# EAGLE design scema (EAGLE 6.5.0)
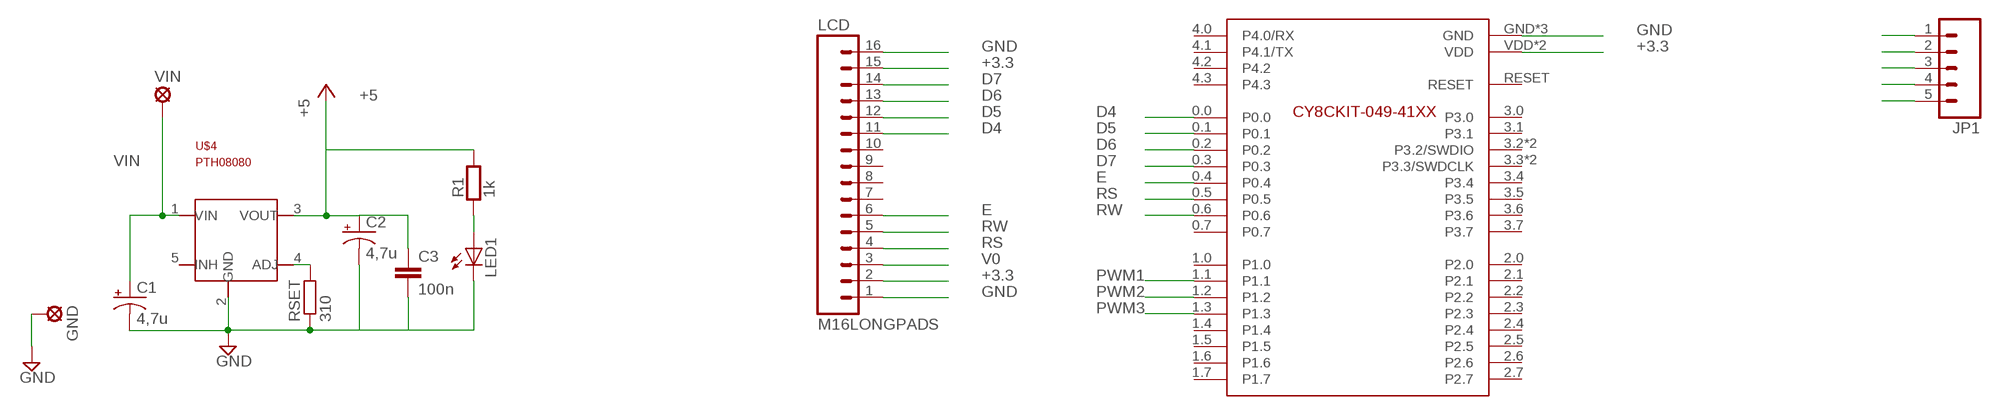
[diagram p0: schematic, sheet 1]

## Parts
C1  4,7u  CAP_POLPTH2  [CPOL-RADIAL-10UF-25V]
C2  4,7u  CAP_POLPTH2  [CPOL-RADIAL-10UF-25V]
C3  100n  CAPPTH2  [CAP-PTH-SMALL2]
GND  SE14  [SE14]
JP1  M05PTH_LONGPADS  [1X05_LONGPADS]
LCD  M16LONGPADS  [1X16_LONGPADS]
LED1  LEDSML0805  [SML0805]
R1  1k  R0805  [0805]
RSET  310  R-EU_R0805  [R0805]
U$1  PSOC4DEV  [CY8CKIT-049-41XX]
U$4  PTH08080  [PTH08080EUF]
VIN  SE14  [SE14]

## Nets
+3.3: JP1.1 LCD.2 LCD.15 U$1.VDD U$1.VDD2(VDD)
+5: C2.1(+) C3.1 R1.2 U$4.3(VOUT)
D4: LCD.11 U$1.0.0
D5: LCD.12 U$1.0.1
D6: LCD.13 U$1.0.2
D7: LCD.14 U$1.0.3
E: LCD.6 U$1.0.4
GND: C1.2(-) C2.2(-) C3.2 GND.MP JP1.2 LCD.1 LCD.16 LED1.C RSET.1 U$1.GND U$1.GND1(GND) U$1.GND2(GND) U$4.2(GND)
N$5: RSET.2 U$4.4(ADJ)
N$12: LED1.A R1.1
PWM1: JP1.3 U$1.1.1
PWM2: JP1.4 U$1.1.2
PWM3: JP1.5 U$1.1.3
RS: LCD.4 U$1.0.5
RW: LCD.5 U$1.0.6
V0: LCD.3
VIN: C1.1(+) U$4.1(VIN) VIN.MP
Unconnected: LCD.7 LCD.8 LCD.9 LCD.10 U$1.0.7 U$1.1.0 U$1.1.4 U$1.1.5 U$1.1.6 U$1.1.7 U$1.2.0 U$1.2.1 U$1.2.2 U$1.2.3 U$1.2.4 U$1.2.5 U$1.2.6 U$1.2.7 U$1.3.0 U$1.3.1 U$1.3.2(P3.2/SWDIO) U$1.3.3(P3.3/SWDCLK) U$1.3.4 U$1.3.5 U$1.3.6 U$1.3.7 U$1.4.0(P4.0/RX) U$1.4.1(P4.1/TX) U$1.4.2 U$1.4.3 U$1.RESET U$1.SWDCLK(P3.3/SWDCLK) U$1.SWDIO(P3.2/SWDIO) U$4.5(INH)

## Library data of the parts
C1 C2 = SparkFun-Passives:CAP_POL: Capacitor Polarized These are standard SMD and PTH capacitors. Normally 10uF, 47uF, and 100uF in electrolytic and tantalum varieties. Always verify the external diameter of the through hole cap, it varies with capacity, voltage, and manufacturer. The EIA devices should be standard.
C3 = SparkFun-Passives:CAP: Capacitor Standard 0603 ceramic capacitor, and 0.1" leaded capacitor.
GND VIN = solpad:SE14: SOLDER PAD E1553, drill 1,4mm, distributor Buerklin, 07F820
JP1 = SparkFun-Connectors:M05: Header 5 Standard 5-pin 0.1" header. Use with straight break away headers (SKU : PRT-00116), right angle break away headers (PRT-00553), swiss pins (PRT-00743), machine pins (PRT-00117), and female headers (PRT-00115). Molex polarized connector foot print use with SKU : PRT-08230 with associated crimp pins and housings.
LCD = SparkFun-Connectors:M16: 1x16 .1" header
LED1 = led:LED: LED OSRAM: - CHIPLED LG R971, LG N971, LY N971, LG Q971, LY Q971, LO R971, LY R971 LH N974, LH R974 LS Q976, LO Q976, LY Q976 LO Q996 - Hyper CHIPLED LW Q18S LB Q993, LB Q99A, LB R99A - SideLED LS A670, LO A670, LY A670, LG A670, LP A670 LB A673, LV A673, LT A673, LW A673 LH A674 LY A675 LS A676, LA A676, LO A676, LY A676, LW A676 LS A679, LY A679, LG A679 - Hyper Micro SIDELED® LS Y876, LA Y876, LO Y876, LY Y876 LT Y87S - SmartLED LW L88C, LW L88S LB L89C, LB L89S, LG L890 LS L89K, LO L89K, LY L89K LS L896, LA L896, LO L896, LY L896 - TOPLED LS T670, LO T670, LY T670, LG T670, LP T670 LSG T670, LSP T670, LSY T670, LOP T670, LYG T670 LG T671, LOG T671, LSG T671 LB T673, LV T673, LT T673, LW T673 LH T674 LS T676, LA T676, LO T676, LY T676, LB T676, LH T676, LSB T676, LW T676 LB T67C, LV T67C, LT T67C, LS T67K, LO T67K, LY T67K, LW E67C LS E67B, LA E67B, LO E67B, LY E67B, LB E67C, LV E67C, LT E67C LW T67C LS T679, LY T679, LG T679 LS T770, LO T770, LY T770, LG T770, LP T770 LB T773, LV T773, LT T773, LW T773 LH T774 LS E675, LA E675, LY E675, LS T675 LS T776, LA T776, LO T776, LY T776, LB T776 LHGB T686 LT T68C, LB T68C - Hyper Mini TOPLED® LB M676 - Mini TOPLED Santana® LG M470 LS M47K, LO M47K, LY M47K Source: http://www.osram.convergy.de LUXEON: - LUMILED® LXK2-PW12-R00, LXK2-PW12-S00, LXK2-PW14-U00, LXK2-PW14-V00 LXK2-PM12-R00, LXK2-PM12-S00, LXK2-PM14-U00 LXK2-PE12-Q00, LXK2-PE12-R00, LXK2-PE12-S00, LXK2-PE14-T00, LXK2-PE14-U00 LXK2-PB12-K00, LXK2-PB12-L00, LXK2-PB12-M00, LXK2-PB14-N00, LXK2-PB14-P00, LXK2-PB14-Q00 LXK2-PR12-L00, LXK2-PR12-M00, LXK2-PR14-Q00, LXK2-PR14-R00 LXK2-PD12-Q00, LXK2-PD12-R00, LXK2-PD12-S00 LXK2-PH12-R00, LXK2-PH12-S00 LXK2-PL12-P00, LXK2-PL12-Q00, LXK2-PL12-R00 Source: www.luxeon.com KINGBRIGHT: KA-3528ASYC Source: www.kingbright.com
R1 = mbed-rlcq:R
RSET = rcl:R-EU_: RESISTOR, European symbol
U$1 = PSoC4-devkit:PSOC4DEV
U$4 = PTH08080:PTH08080: DC-DC, Vin 5..18V, Vout 2..6V, 2A www.ti.com

## Net classes
0 VIN: width 12.6 mm

## Board
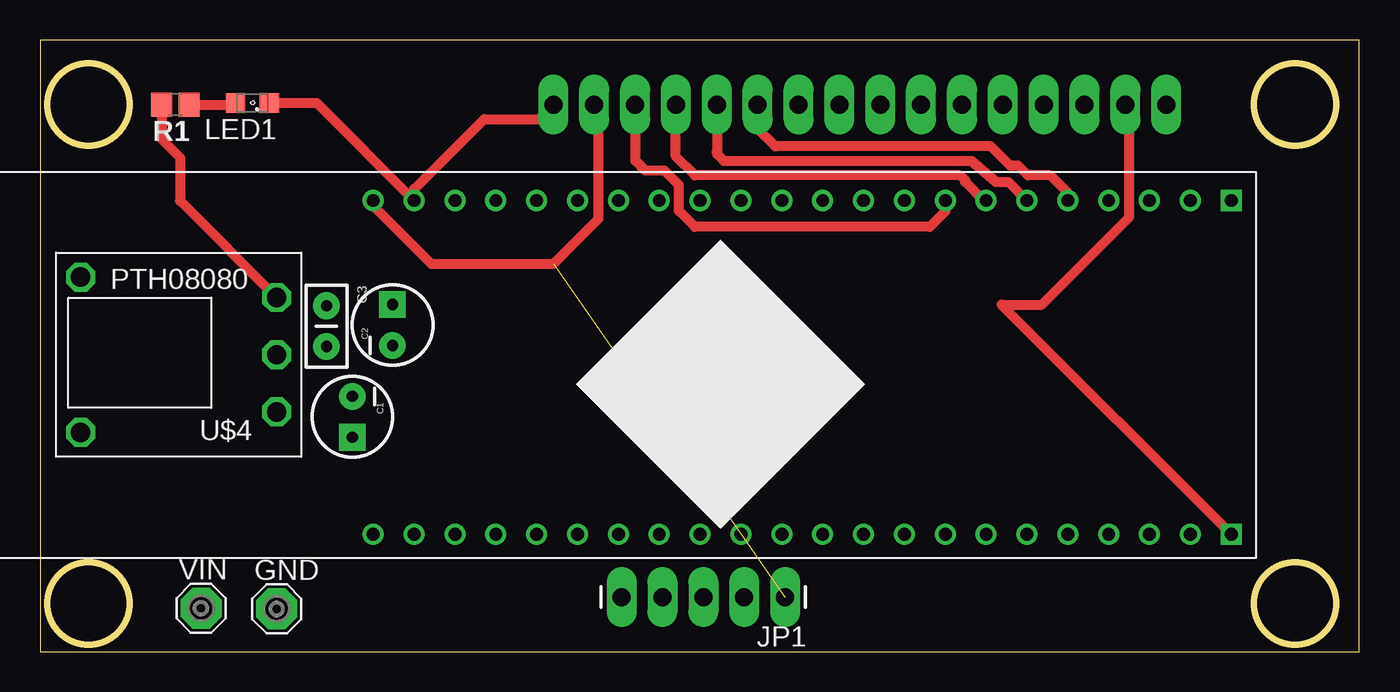
[diagram p1: board, top side]
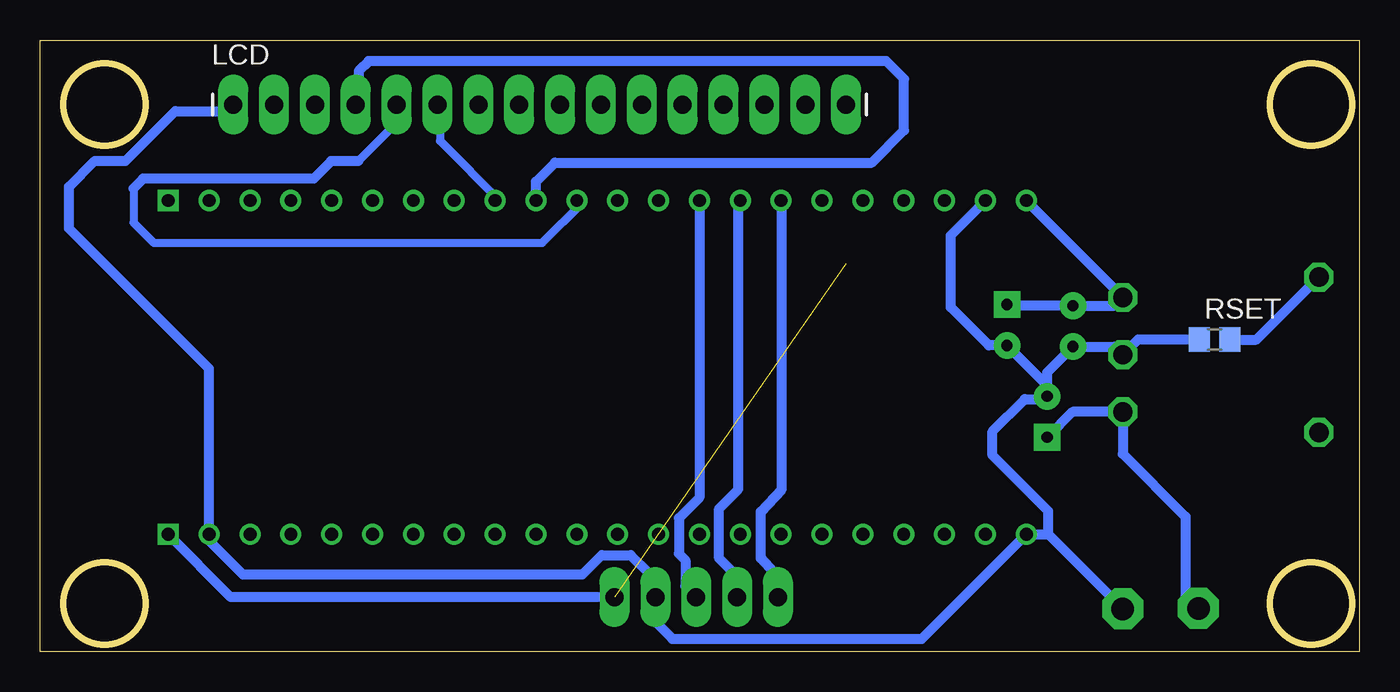
[diagram p2: board, bottom side, seen from below]

Size 82 x 38 mm. Coordinates in mm from the lower left corner, seen from the top.
Outline: 0,0 82,0 82,38 0,38 0,0
Outline: circle at 3,34 radius 2.54
Outline: circle at 78,34 radius 2.54
Outline: circle at 3,3 radius 2.54
Outline: circle at 78,3 radius 2.54
Copper layers (1*16): Top 0.1mm / dielectric 1.5mm / Bottom 0.1mm
Design rules "ensea": minimum track width 0.5mm, minimum drill 0.5mm, track to track 0.5mm, track to pad 0.5mm, pad to pad 0.5mm, via to via 0.5mm, smd to smd 8mil, copper to edge 40mil, drill to drill 8mil, minimum pad ring 10mil, minimum via ring 8mil, stop-mask expansion 4mil, vias tented up to drill 0mil, thermal gap 10mil

### Footprints (pad centres in the part's own frame; a part is rotated, then mirrored left to right if it is on the bottom)
CPOL-RADIAL-10UF-25V = drill 0.7 pad 1.651 square: 1 1.27,0 | drill 0.7 pad 1.651: 2 -1.27,0
CAP-PTH-SMALL2 = drill 0.7 pad 1.651: 1 0,0; 2 2.54,0
SE14 = drill 1.397 pad 2.54 octagon: MP 0,0
1X05_LONGPADS = drill 1.118 pad 1.88 long: 1 0,0; 2 2.54,0; 3 5.08,0; 4 7.62,0; 5 10.16,0
1X16_LONGPADS = drill 1.118 pad 1.88 long: 1 0,0; 2 2.54,0; 3 5.08,0; 4 7.62,0; 5 10.16,0; 6 12.7,0; 7 15.24,0; 8 17.78,0; 9 20.32,0; 10 22.86,0; 11 25.4,0; 12 27.94,0; 13 30.48,0; 14 33.02,0; 15 35.56,0; 16 38.1,0
SML0805 = smd 1.2 x 1.2: A 1.05,0; C -1.05,0
0805 = smd 1.3 x 1.5: 1 -0.85,0; 2 0.85,0
R0805 = smd 1.3 x 1.5: 1 -0.95,0; 2 0.95,0
CY8CKIT-049-41XX = drill 0.8: 0.0 -10.16,22.86; 0.1 -10.16,20.32; 0.2 -10.16,17.78; 0.3 -10.16,15.24; 0.4 -10.16,12.7; 0.5 -10.16,10.16; 0.6 -10.16,7.62; 0.7 -10.16,5.08; 1.0 -10.16,2.54; 1.1 -10.16,0; 1.2 -10.16,-2.54; 1.3 -10.16,-5.08; 1.4 -10.16,-7.62; 1.5 -10.16,-10.16; 1.6 -10.16,-12.7; 1.7 -10.16,-15.24; 2.0 10.59,-17.78; 2.1 10.59,-15.24; 2.2 10.59,-12.7; 2.3 10.59,-10.16; 2.4 10.59,-7.62; 2.5 10.59,-5.08; 2.6 10.59,-2.54; 2.7 10.59,0; 3.0 10.59,2.54; 3.1 10.59,5.08; 3.2 10.59,7.62; 3.3 10.59,10.16; 3.4 10.59,12.7; 3.5 10.59,15.24; 3.6 10.59,17.78; 3.7 10.59,20.32; 4.1 -10.16,30.48; 4.2 -10.16,27.94; 4.3 -10.16,25.4; GND -10.16,-17.78; GND1 10.59,-20.32; GND2 10.59,30.48; RESET 10.59,27.94; SWDCLK 10.59,25.4; SWDIO 10.59,22.86; VDD -10.16,-20.32 | drill 0.8 square: 4.0 -10.16,33.02; VDD2 10.59,33.02
PTH08080EUF = drill 1.2 octagon: 1 0,0; 2 0,-3.556; 3 0,-7.112; 4 12.192,-8.382; 5 12.192,1.27

### Placement (x,y rotation side)
C1  19.4,14.6 270 top
C2  21.9,20.3 90 top
C3  17.8,21.5 270 top
GND  14.7,2.66 0 top
JP1  46.3,3.4 180 top
LCD  70,34 0 bottom
LED1  13.2,34.1 180 top
R1  8.4,34 180 top
RSET  9,19.4 0 bottom
U$1  41.02,17.88 270 top
U$4  14.7,14.9 180 top
VIN  10,2.7 0 top

### Tracks (layer width: path | path; a pad name or v marks a point on that pad's centre or on a via)
+3.3  (1 unrouted)
  Top 0.61: U$1.VDD 20.7,27.7 24.3,24.1 31.9,24.1 34.7,26.9 34.7,33.74 LCD.15 | U$1.VDD2 59.76,21.57 62.27,21.57 67.7,27 67.7,33.76 LCD.2
  Bottom 0.61: JP1.1 70.15,3.4 U$1.VDD2 | 14.7,22.04 U$1.VDD
+5
  Top 0.61: R1.2 7.55,31.85 8.7,30.7 8.7,28.01 U$4.3
  Bottom 0.61: C2.1 21.83,21.5 C3.1 15.21,21.5 U$4.3
D4
  Top 0.61: U$1.0.0 63.88,28.52 62.8,29.6 61.4,29.6 60.8,30.2 60.3,30.2 59.1,31.4 45.7,31.4 44.6,32.5 LCD.11
D5
  Top 0.61: LCD.12 42.06,31.04 42.1,31 42.1,30.9 42.5,30.5 57.9,30.5 59.4,29.2 60.18,29.2 U$1.0.1
D6
  Top 0.61: U$1.0.2 58.66,28.04 57.5,29.2 57.5,29.3 57.2,29.6 40.7,29.6 39.5,30.8 39.5,33.98 LCD.13
D7
  Top 0.61: U$1.0.3 56.26,27.36 55.3,26.4 40.7,26.4 39.7,27.4 39.7,29 38.8,29.9 37.6,29.9 37,30.5 37,33.98 LCD.14
E
  Bottom 0.5: U$1.0.4 53.34,27.94 57.15,31.75 57.15,33.02 LCD.6
GND
  Top 0.61: LED1.C 17.18,34.1 U$1.GND 23.24,28.74 27.6,33.1 31,33.1 LCD.16
  Bottom 0.61: 19.33,7.29 U$1.GND1 27.19,0.8 42.7,0.8 43.76,1.86 JP1.2 44.2,3.84 44.2,4.9 45.3,6 47.1,6 48.3,4.8 69.4,4.8 71.5,6.9 U$1.GND2 71.5,17.6 80.2,26.3 80.2,28.9 78.6,30.5 76.7,30.5 73.6,33.6 70.4,33.6 LCD.1 | 19.33,7.29 GND.MP | RSET.1 13.76,19.4 U$4.2 15.2,18.96 C3.2 19.4,17.36 C1.2 | C1.2 19.4,16.53 C2.2 23.03,19.03 25.4,21.4 25.4,25.88 U$1.GND | 19.33,7.29 19.33,8.73 22.8,12.2 22.8,13.7 20.8,15.7 19.57,15.7 C1.2
N$5
  Bottom 0.61: RSET.2 6.39,19.4 U$4.4
N$12
  Top 0.61: R1.1 12.05,34 LED1.A
PWM1
  Bottom 0.61: U$1.1.1 41.02,9.58 42.3,8.3 42.3,6.1 41.9,5.7 41.9,4.08 JP1.3
PWM2
  Bottom 0.61: JP1.4 38.68,4.68 39.8,5.8 39.8,8.9 38.6,10.1 38.6,27.92 U$1.1.2
PWM3
  Bottom 0.61: JP1.5 36.14,4.64 37.2,5.8 37.2,8.7 35.9,10.1 35.9,28 U$1.1.3
RS
  Bottom 0.61: 62.38,35.48 LCD.4 62.2,34.18 62.2,36.1 61.6,36.7 29.4,36.7 28.3,35.6 28.3,32.4 30.3,30.4 50,30.4 51.18,29.22 U$1.0.5
RW
  Bottom 0.5: 76.2,28.8 76.2,26.67 74.93,25.4 50.8,25.4 48.26,27.94 U$1.0.6 | 62.23,30.48 59.69,33.02 LCD.5
  Bottom 0.61: 62.23,30.48 63.92,30.48 65,29.4 75.6,29.4 76.2,28.8
VIN
  Bottom 0.61: C1.1 17.83,14.9 U$4.1 14.7,12.3 10.8,8.4 10.8,3.5 VIN.MP